# EAGLE design angle_brick (EAGLE 7.2.0)
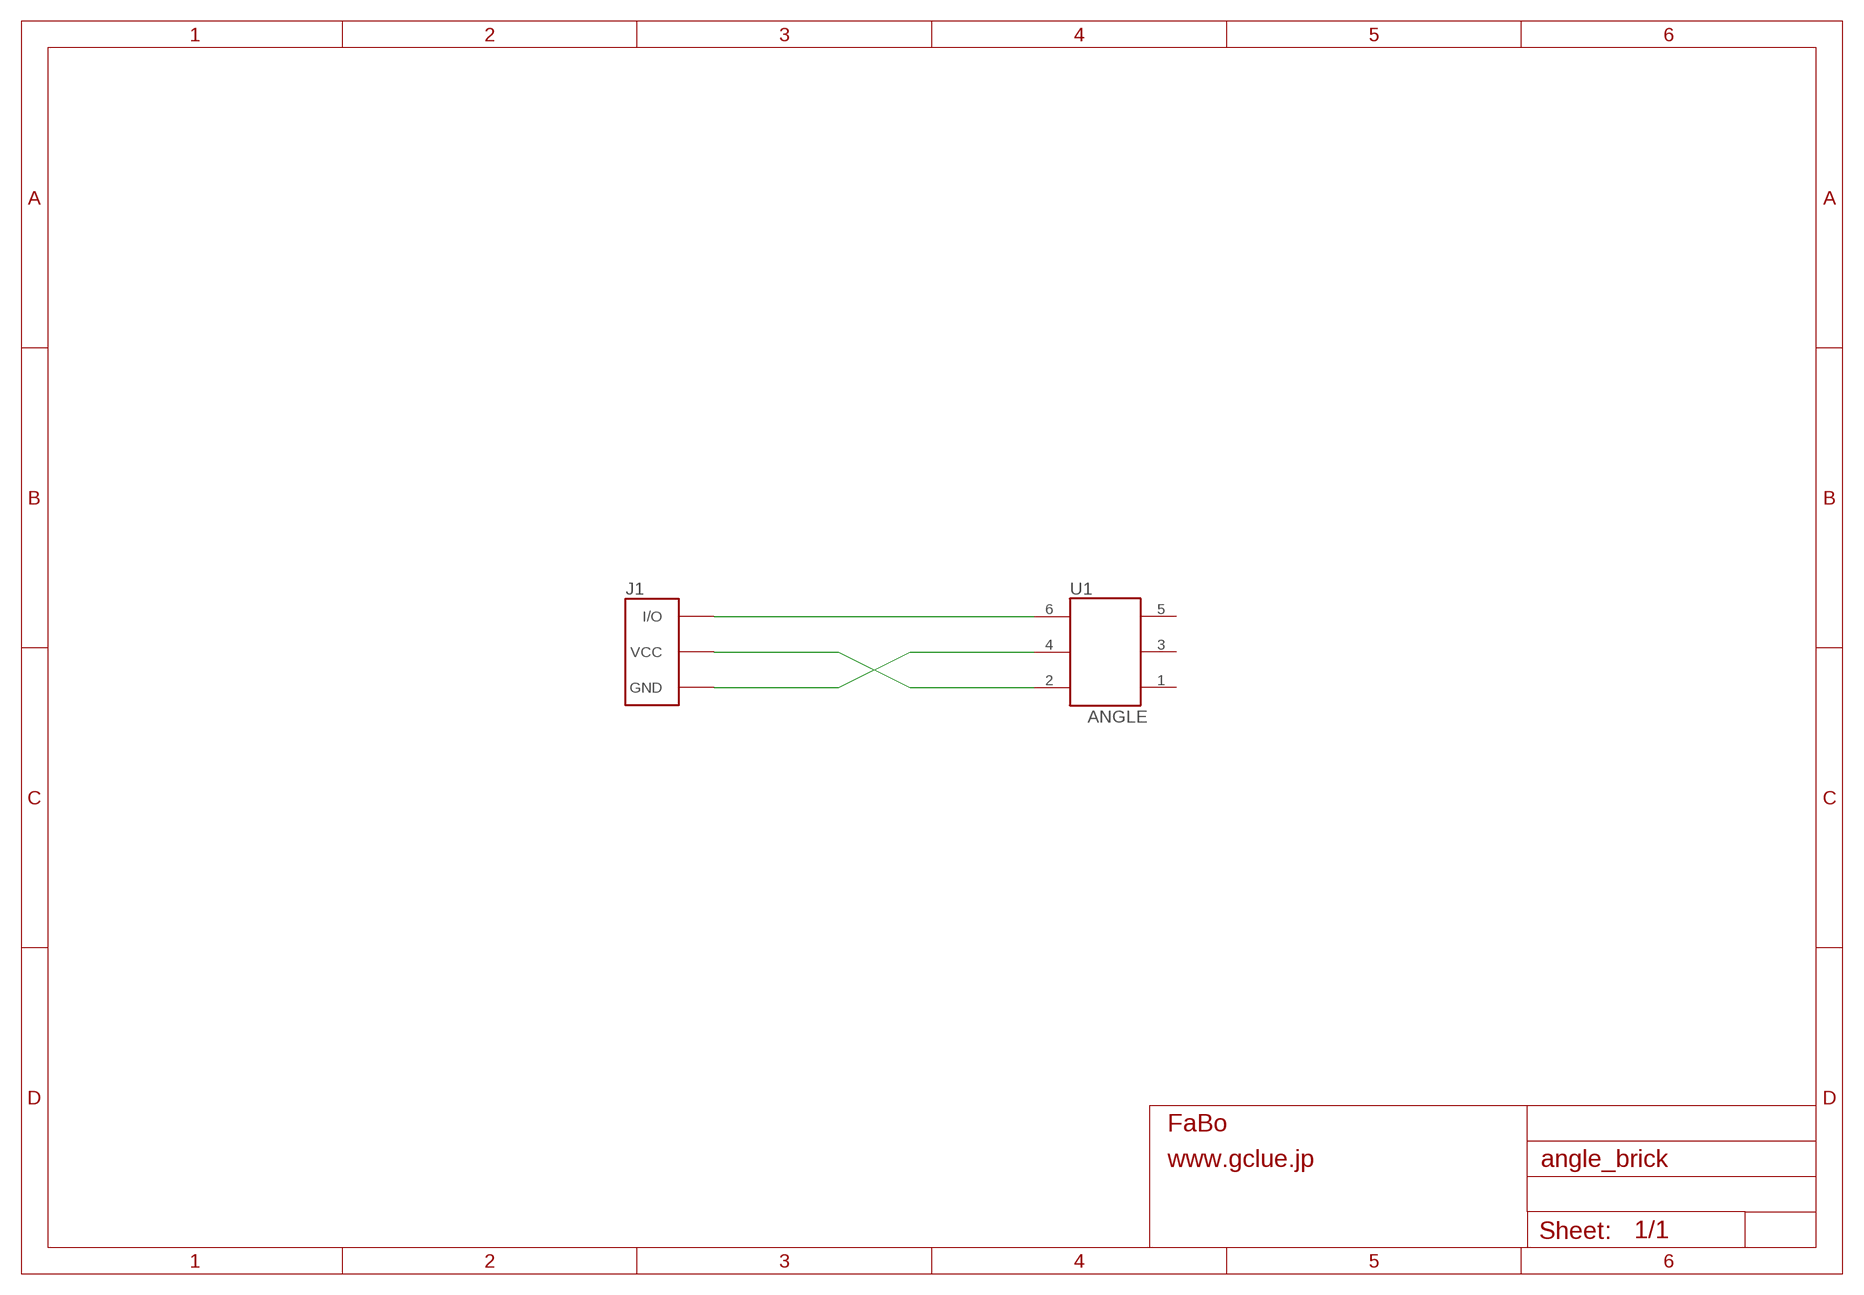
[diagram p0: schematic, sheet 1]

## Parts
J1  3PIN  BRICK_3PIN  [BRICK_3PIN]
U1  ANGLE  ROTARYENCORDER_BRICK  [ROTARYENCORDER_BRICK]

## Nets
GND: J1.GND U1.4
N$1: J1.IN/OUT(I/O) U1.6
VCC: J1.VCC U1.2
Unconnected: U1.1 U1.3 U1.5

## Library data of the parts
J1 = gclue:BRICK_3PIN: FaBo Brick 3pin
U1 = gclue:ROTARYENCORDER_BRICK: Rotary Encorder for Brick

## Board
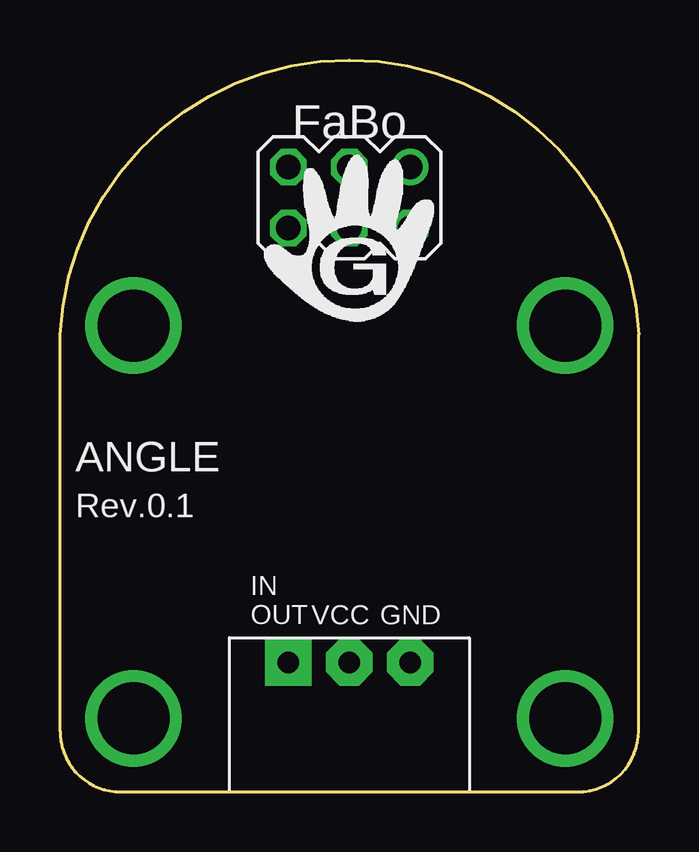
[diagram p1: board, top side]
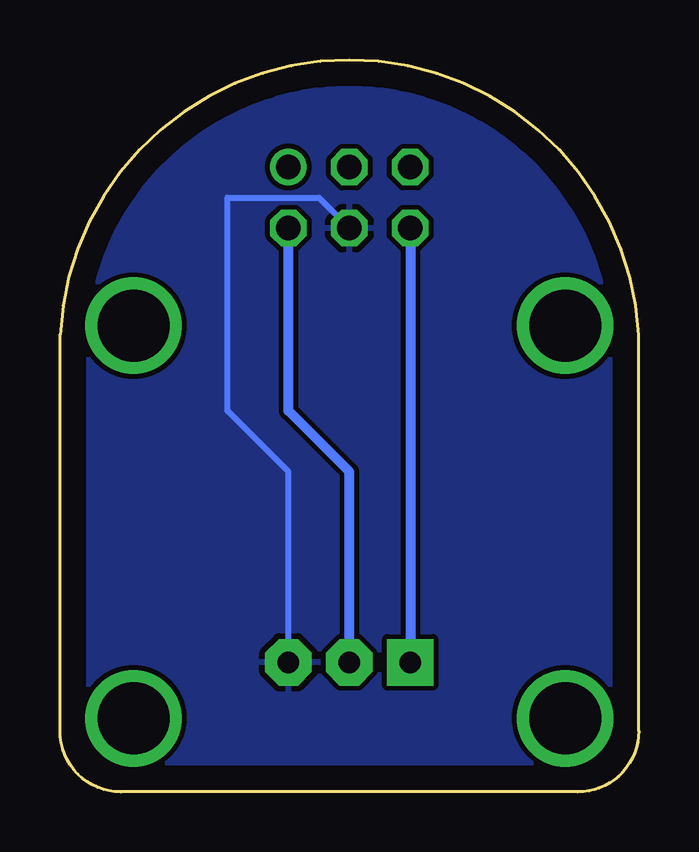
[diagram p2: board, bottom side, seen from below]

Size 24.13 x 30.5 mm. Coordinates in mm from the lower left corner, seen from the top.
Copper layers (1*16): Top 0.035mm / dielectric 1.5mm / Bottom 0.035mm
Design rules "default": minimum track width 10mil, minimum drill 24mil, track to track 8mil, track to pad 8mil, pad to pad 8mil, via to via 8mil, smd to smd 8mil, copper to edge 40mil, drill to drill 8mil, minimum pad ring 10mil, minimum via ring 8mil, stop-mask expansion 4mil, vias tented up to drill 0mil, thermal gap 10mil

### Footprints (pad centres in the part's own frame; a part is rotated, then mirrored left to right if it is on the bottom)
BRICK_3PIN = drill 0.9 pad 1.93 octagon: GND 2.54,-8.572; VCC 0,-8.572 | drill 0.9 pad 1.93 square: IN/OUT -2.54,-8.572 | drill 3 pad 3.81: P$1 -9,5.46; P$2 9,5.46; P$3 9,-10.905; P$4 -9,-10.905
ROTARYENCORDER_BRICK = drill 1.016: 1 -2.54,-1.27 | drill 1.016 octagon: 2 -2.54,1.27; 3 0,-1.27; 4 0,1.27; 5 2.54,-1.27; 6 2.54,1.27

### Placement (x,y rotation side)
J1  12.06,13.97 0 top
U1  12.06,24.77 180 top

### Tracks (layer width: path | path; a pad name or v marks a point on that pad's centre or on a via)
GND
  Bottom 0.254: J1.GND 14.61,13.34 17.15,15.88 17.15,24.77 13.34,24.77 U1.4
  pour Bottom: -0.63,-0.63 24.77,-0.63 24.77,31.12 -0.63,31.12
N$1
  Bottom 0.406: U1.6 J1.IN/OUT
VCC
  Bottom 0.406: J1.VCC 12.06,13.34 14.61,15.88 U1.2

### Text on the board
tPlace: ANGLE | Rev.0.1 | IN / OUT | VCC | GND